# Altium schematic sheet BMC.SchDoc
size 420 x 297 mm; Scale: 1:1; DocumentType: Схема электрическая принципиальная; SheetNumber: 30; SheetTotal: 32; DocumentTypeShort: Э3; DocumentInvertoryNumber: ㅤ
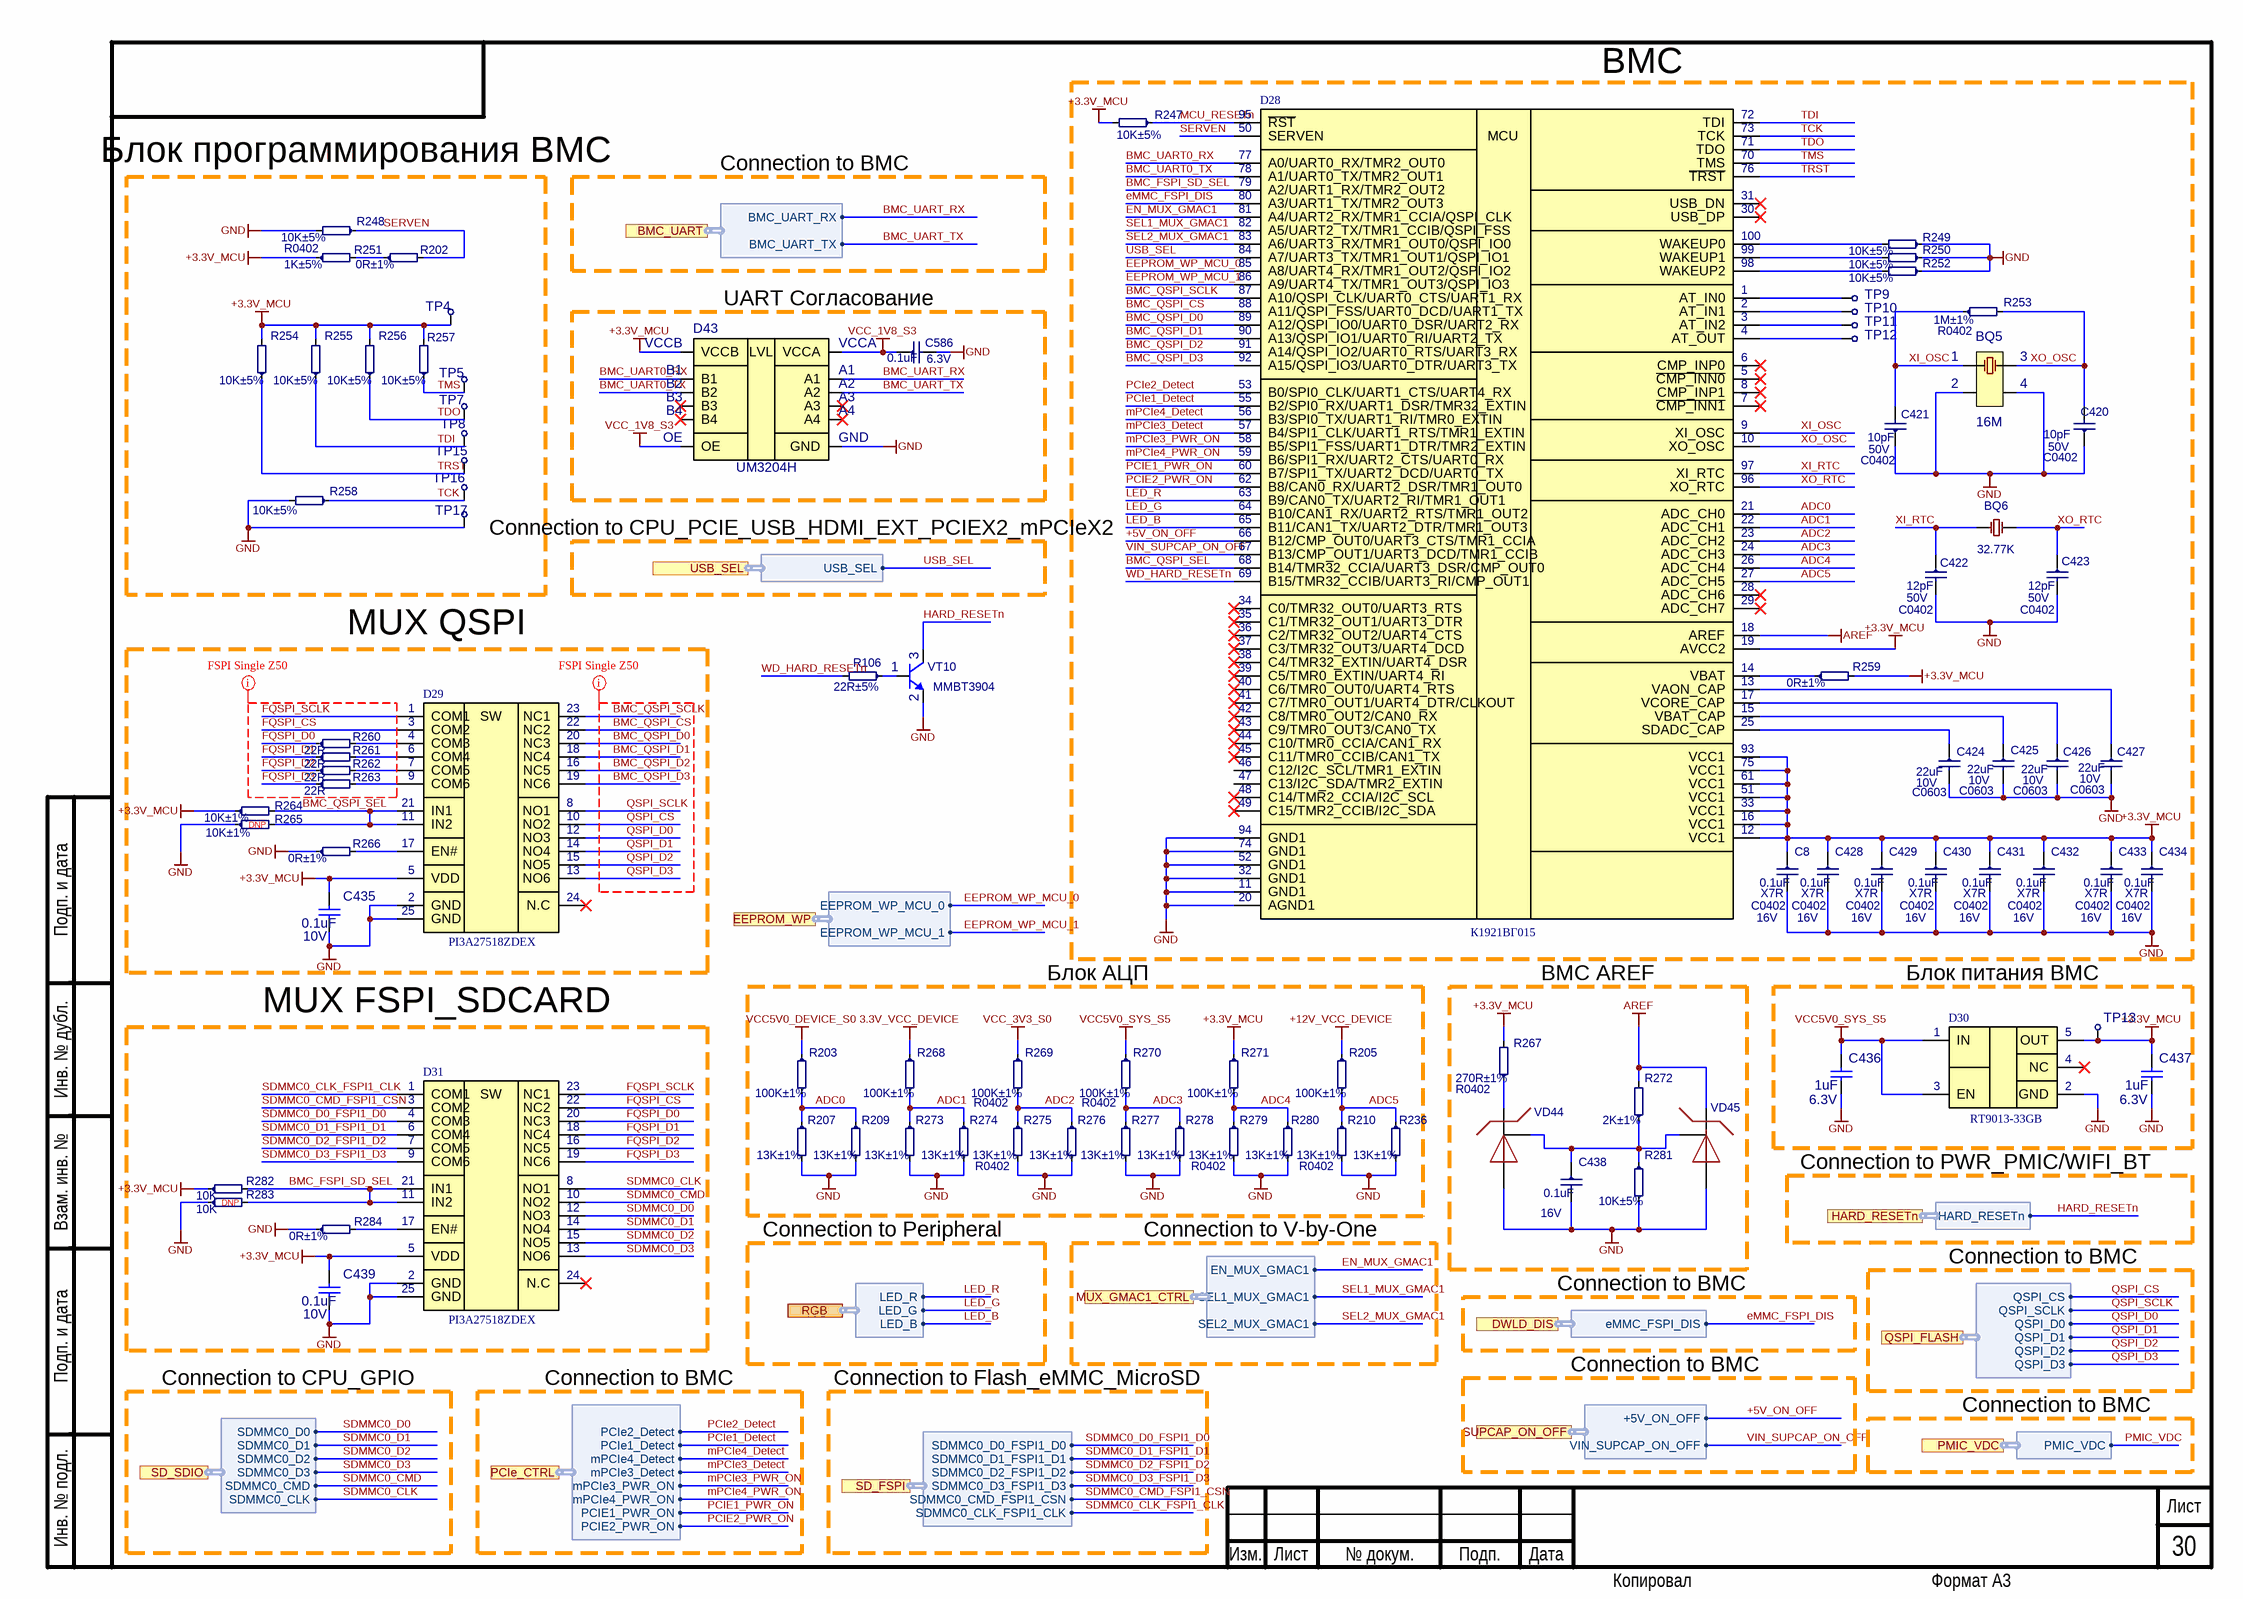
[diagram p0: BMC.SchDoc]

## Parts
BQ5  16M  [NX3225GA]
BQ6  32.77K  [FC-12M]
C8  0.1uF  Dielectric: X7R  Voltage: 16V  [C0402]
C420  10pF  Voltage: 50V  [C0402]
C421  10pF  Voltage: 50V  [C0402]
C422  12pF  Voltage: 50V  [C0402]
C423  12pF  Voltage: 50V  [C0402]
C424  22uF  Voltage: 10V  [C0603]
C425  22uF  Voltage: 10V  [C0603]
C426  22uF  Voltage: 10V  [C0603]
C427  22uF  Voltage: 10V  [C0603]
C428  0.1uF  Dielectric: X7R  Voltage: 16V  [C0402]
C429  0.1uF  Dielectric: X7R  Voltage: 16V  [C0402]
C430  0.1uF  Dielectric: X7R  Voltage: 16V  [C0402]
C431  0.1uF  Dielectric: X7R  Voltage: 16V  [C0402]
C432  0.1uF  Dielectric: X7R  Voltage: 16V  [C0402]
C433  0.1uF  Dielectric: X7R  Voltage: 16V  [C0402]
C434  0.1uF  Dielectric: X7R  Voltage: 16V  [C0402]
C435  0.1uF  Voltage: 10V  [C0402]
C436  1uF  Voltage: 6.3V  [C0402]
C437  1uF  Voltage: 6.3V  [C0402]
C438  0.1uF  Voltage: 16V  [C0402]
C439  0.1uF  Voltage: 10V  [C0402]
C586  0.1uF  Voltage: 6.3V  [C0201]
D28  К1921ВГ015  [К1921ВГ015]
D29  PI3A27518ZDEX  [PI3A27518ZDEX]
D30  RT9013-33GB  [RT9013-25GB]
D31  PI3A27518ZDEX  [PI3A27518ZDEX]
D43  UM3204H  [UM3204H]
R106  22R±5%  [R0402]
R202  0R±1%  [R0402]
R203  100K±1%  [R0402]
R205  100K±1%  [R0402]
R207  13K±1%  [R0402]
R209  13K±1%  [R0402]
R210  13K±1%  [R0402]
R236  13K±1%  [R0402]
R247  10K±5%  [R0402]
R248  10K±5%  [R0402]
R249  10K±5%  [R0402]
R250  10K±5%  [R0402]
R251  1K±5%  [R0402]
R252  10K±5%  [R0402]
R253  1M±1%  [R0402]
R254  10K±5%  [R0402]
R255  10K±5%  [R0402]
R256  10K±5%  [R0402]
R257  10K±5%  [R0402]
R258  10K±5%  [R0402]
R259  0R±1%  [R0402]
R260  22R  [R0402]
R261  22R  [R0402]
R262  22R  [R0402]
R263  22R  [R0402]
R264  10K±1%  [R0402]
R265  10K±1%  [R0402]
R266  0R±1%  [R0402]
R267  270R±1%  [R0402]
R268  100K±1%  [R0402]
R269  100K±1%  [R0402]
R270  100K±1%  [R0402]
R271  100K±1%  [R0402]
R272  2K±1%  [R0402]
R273  13K±1%  [R0402]
R274  13K±1%  [R0402]
R275  13K±1%  [R0402]
R276  13K±1%  [R0402]
R277  13K±1%  [R0402]
R278  13K±1%  [R0402]
R279  13K±1%  [R0402]
R280  13K±1%  [R0402]
R281  10K±5%  [R0402]
R282  10K  [R0402]
R283  10K  [R0402]
R284  0R±1%  [R0402]
TP4  Тестовая точка  [TEST]  (value not drawn)  (no BOM)
TP5  Тестовая точка  [TEST]  (value not drawn)  (no BOM)
TP7  Тестовая точка  [TEST]  (value not drawn)  (no BOM)
TP8  Тестовая точка  [TEST]  (value not drawn)  (no BOM)
TP9  Тестовая точка  [TEST]  (value not drawn)  (no BOM)
TP10  Тестовая точка  [TEST]  (value not drawn)  (no BOM)
TP11  Тестовая точка  [TEST]  (value not drawn)  (no BOM)
TP12  Тестовая точка  [TEST]  (value not drawn)  (no BOM)
TP13  Тестовая точка  [TEST]  (value not drawn)  (no BOM)
TP15  Тестовая точка  [TEST]  (value not drawn)  (no BOM)
TP16  Тестовая точка  [TEST]  (value not drawn)  (no BOM)
TP17  Тестовая точка  [TEST]  (value not drawn)  (no BOM)
VD44  TL431AIDBZR  [TL431AIDBZR]  (value not drawn)
VD45  TL432AIDBZR  [TL432AIDBZR]  (value not drawn)
VT10  MMBT3904  [SOT23]

## Blocks framed on the sheet
UART Согласование: C586 D43
Блок АЦП: R203 R205 R207 R209 R210 R236 R268-R271 R273-R280
BMC AREF: C438 R267 R272 R281 VD44 VD45
Блок питания BMC: C436 C437 D30 TP13

## Ports
BMC_UART (harness BMC_UART), DWLD_DIS (harness DWLD_DIS), EEPROM_WP (harness EEPROM_WP), HARD_RESETn (harness HARD_RESETn), MUX_GMAC1_CTRL (harness MUX_GMAC1_CTRL), PCIe_CTRL (harness PCIe_CTRL), PMIC_VDC (harness PMIC_VDC), QSPI_FLASH (harness QSPI_FLASH), RGB (harness RGB), SD_FSPI (harness SD_FSPI), SD_SDIO (harness SD_SDIO), SUPCAP_ON_OFF (harness SUPCAP_ON_OFF), USB_SEL (harness USB_SEL)

## Harnesses
PCIe_CTRL: PCIe2_Detect, PCIe1_Detect, mPCIe4_Detect, mPCIe3_Detect, mPCIe3_PWR_ON, mPCIe4_PWR_ON, PCIE1_PWR_ON, PCIE2_PWR_ON
SD_SDIO: SDMMC0_D0, SDMMC0_D1, SDMMC0_D2, SDMMC0_D3, SDMMC0_CMD, SDMMC0_CLK
SD_FSPI: SDMMC0_D0_FSPI1_D0, SDMMC0_D1_FSPI1_D1, SDMMC0_D2_FSPI1_D2, SDMMC0_D3_FSPI1_D3, SDMMC0_CMD_FSPI1_CSN, SDMMC0_CLK_FSPI1_CLK
QSPI_FLASH: QSPI_CS, QSPI_SCLK, QSPI_D0, QSPI_D1, QSPI_D2, QSPI_D3
SUPCAP_ON_OFF: +5V_ON_OFF, VIN_SUPCAP_ON_OFF
PMIC_VDC: PMIC_VDC
DWLD_DIS: eMMC_FSPI_DIS
RGB: LED_G, LED_R, LED_B
MUX_GMAC1_CTRL: SEL1_MUX_GMAC1, EN_MUX_GMAC1, SEL2_MUX_GMAC1
HARD_RESETn: HARD_RESETn
BMC_UART: BMC_UART_RX, BMC_UART_TX
USB_SEL: USB_SEL
EEPROM_WP: EEPROM_WP_MCU_0, EEPROM_WP_MCU_1

## Nets
3.3V_VCC_DEVICE: R268.1
+3.3V_MCU: C8.1 C428.1 C429.1 C430.1 C431.1 C432.1 C433.1 C434.1 C435.2 C437.2 C439.2 D28.12(VCC1) D28.16(VCC1) D28.19(AVCC2) D28.33(VCC1) D28.51(VCC1) D28.61(VCC1) D28.75(VCC1) D28.93(VCC1) D29.5(VDD) D30.5(OUT) D31.5(VDD) D43.VCCB R247.2 R251.1 R254.2 R255.2 R256.2 R257.2 R259.2 R264.1 R267.2 R271.1 R282.1 TP4.1 TP13.1
+12V_VCC_DEVICE: R205.1
AREF: D28.18(AREF) R272.2 VD45.2(K)
GND: BQ5.2 BQ5.4 C8.2 C420.1 C421.1 C422.2 C423.2 C424.2 C425.2 C426.2 C427.2 C428.2 C429.2 C430.2 C431.2 C432.2 C433.2 C434.2 C435.1 C436.1 C437.1 C438.2 C439.1 C586.2 D28.11(GND1) D28.20(AGND1) D28.32(GND1) D28.52(GND1) D28.74(GND1) D28.94(GND1) D29.2(GND) D29.25(GND) D30.2(GND) D31.2(GND) D31.25(GND) D43.GND R207.2 R209.2 R210.2 R236.2 R248.2 R249.1 R250.1 R252.1 R258.2 R265.1 R266.1 R273.2 R274.2 R275.2 R276.2 R277.2 R278.2 R279.2 R280.2 R281.2 R283.1 R284.1 TP17.1 VD44.3(A) VD45.3(A) VT10.2(E)
VCC5V0_DEVICE_S0: R203.1
VCC5V0_SYS_S5: C436.2 D30.1(IN) D30.3(EN) R270.1
VCC_1V8_S3: C586.1 D43.OE D43.VCCA
VCC_3V3_S0: R269.1
+5V_ON_OFF: D28.66(B12/CMP_OUT0/UART3_CTS/TMR1_CCIA) ; port SUPCAP_ON_OFF.+5V_ON_OFF
ADC0: D28.21(ADC_CH0) R203.2 R207.1 R209.1
ADC1: D28.22(ADC_CH1) R268.2 R273.1 R274.1
ADC2: D28.23(ADC_CH2) R269.2 R275.1 R276.1
ADC3: D28.24(ADC_CH3) R270.2 R277.1 R278.1
ADC4: D28.26(ADC_CH4) R271.2 R279.1 R280.1
ADC5: D28.27(ADC_CH5) R205.2 R210.1 R236.1
BMC_FSPI_SD_SEL: D28.79(A2/UART1_RX/TMR2_OUT2) D31.11(IN2) D31.21(IN1) R282.2 R283.2
BMC_QSPI_CS: D28.88(A11/QSPI_FSS/UART0_DCD/UART1_TX) D29.22(NC2)
BMC_QSPI_D0: D28.89(A12/QSPI_IO0/UART0_DSR/UART2_RX) D29.20(NC3)
BMC_QSPI_D1: D28.90(A13/QSPI_IO1/UART0_RI/UART2_TX) D29.18(NC4)
BMC_QSPI_D2: D28.91(A14/QSPI_IO2/UART0_RTS/UART3_RX) D29.16(NC5)
BMC_QSPI_D3: D28.92(A15/QSPI_IO3/UART0_DTR/UART3_TX) D29.19(NC6)
BMC_QSPI_SCLK: D28.87(A10/QSPI_CLK/UART0_CTS/UART1_RX) D29.23(NC1)
BMC_QSPI_SEL: D28.68(B14/TMR32_CCIA/UART3_DSR/CMP_OUT0) D29.11(IN2) D29.21(IN1) R264.2 R265.2
BMC_UART0_RX: D28.77(A0/UART0_RX/TMR2_OUT0) D43.B1
BMC_UART0_TX: D28.78(A1/UART0_TX/TMR2_OUT1) D43.B2
BMC_UART_RX: D43.A1 ; port BMC_UART.BMC_UART_RX
BMC_UART_TX: D43.A2 ; port BMC_UART.BMC_UART_TX
EEPROM_WP_MCU_0: D28.85(A8/UART4_RX/TMR1_OUT2/QSPI_IO2) ; port EEPROM_WP.EEPROM_WP_MCU_0
EEPROM_WP_MCU_1: D28.86(A9/UART4_TX/TMR1_OUT3/QSPI_IO3) ; port EEPROM_WP.EEPROM_WP_MCU_1
eMMC_FSPI_DIS: D28.80(A3/UART1_TX/TMR2_OUT3) ; port DWLD_DIS.eMMC_FSPI_DIS
EN_MUX_GMAC1: D28.81(A4/UART2_RX/TMR1_CCIA/QSPI_CLK) ; port MUX_GMAC1_CTRL.EN_MUX_GMAC1
FQSPI_CS: D29.3(COM2) D31.22(NC2)
FQSPI_D0: D31.20(NC3) R260.1
FQSPI_D1: D31.18(NC4) R261.1
FQSPI_D2: D31.16(NC5) R262.1
FQSPI_D3: D31.19(NC6) R263.1
FQSPI_SCLK: D29.1(COM1) D31.23(NC1)
HARD_RESETn: VT10.3(C) ; port HARD_RESETn.HARD_RESETn
LED_B: D28.65(B11/CAN1_TX/UART2_DTR/TMR1_OUT3) ; port RGB.LED_B
LED_G: D28.64(B10/CAN1_RX/UART2_RTS/TMR1_OUT2) ; port RGB.LED_G
LED_R: D28.63(B9/CAN0_TX/UART2_RI/TMR1_OUT1) ; port RGB.LED_R
MCU_RESETn: D28.95(~{RST}) R247.1
mPCIe3_Detect: D28.57(B4/SPI1_CLK/UART1_RTS/TMR1_EXTIN) ; port PCIe_CTRL.mPCIe3_Detect
mPCIe3_PWR_ON: D28.58(B5/SPI1_FSS/UART1_DTR/TMR2_EXTIN) ; port PCIe_CTRL.mPCIe3_PWR_ON
mPCIe4_Detect: D28.56(B3/SPI0_TX/UART1_RI/TMR0_EXTIN) ; port PCIe_CTRL.mPCIe4_Detect
mPCIe4_PWR_ON: D28.59(B6/SPI1_RX/UART2_CTS/UART0_RX) ; port PCIe_CTRL.mPCIe4_PWR_ON
PCIe1_Detect: D28.55(B2/SPI0_RX/UART1_DSR/TMR32_EXTIN) ; port PCIe_CTRL.PCIe1_Detect
PCIE1_PWR_ON: D28.60(B7/SPI1_TX/UART2_DCD/UART0_TX) ; port PCIe_CTRL.PCIE1_PWR_ON
PCIe2_Detect: D28.53(B0/SPI0_CLK/UART1_CTS/UART4_RX) ; port PCIe_CTRL.PCIe2_Detect
PCIE2_PWR_ON: D28.62(B8/CAN0_RX/UART2_DSR/TMR1_OUT0) ; port PCIe_CTRL.PCIE2_PWR_ON
PMIC_VDC: port PMIC_VDC.PMIC_VDC
QSPI_CS: D29.10(NO2) ; port QSPI_FLASH.QSPI_CS
QSPI_D0: D29.12(NO3) ; port QSPI_FLASH.QSPI_D0
QSPI_D1: D29.14(NO4) ; port QSPI_FLASH.QSPI_D1
QSPI_D2: D29.15(NO5) ; port QSPI_FLASH.QSPI_D2
QSPI_D3: D29.13(NO6) ; port QSPI_FLASH.QSPI_D3
QSPI_SCLK: D29.8(NO1) ; port QSPI_FLASH.QSPI_SCLK
SDMMC0_CLK: D31.8(NO1) ; port SD_SDIO.SDMMC0_CLK
SDMMC0_CLK_FSPI1_CLK: D31.1(COM1) ; port SD_FSPI.SDMMC0_CLK_FSPI1_CLK
SDMMC0_CMD: D31.10(NO2) ; port SD_SDIO.SDMMC0_CMD
SDMMC0_CMD_FSPI1_CSN: D31.3(COM2) ; port SD_FSPI.SDMMC0_CMD_FSPI1_CSN
SDMMC0_D0: D31.12(NO3) ; port SD_SDIO.SDMMC0_D0
SDMMC0_D0_FSPI1_D0: D31.4(COM3) ; port SD_FSPI.SDMMC0_D0_FSPI1_D0
SDMMC0_D1: D31.14(NO4) ; port SD_SDIO.SDMMC0_D1
SDMMC0_D1_FSPI1_D1: D31.6(COM4) ; port SD_FSPI.SDMMC0_D1_FSPI1_D1
SDMMC0_D2: D31.15(NO5) ; port SD_SDIO.SDMMC0_D2
SDMMC0_D2_FSPI1_D2: D31.7(COM5) ; port SD_FSPI.SDMMC0_D2_FSPI1_D2
SDMMC0_D3: D31.13(NO6) ; port SD_SDIO.SDMMC0_D3
SDMMC0_D3_FSPI1_D3: D31.9(COM6) ; port SD_FSPI.SDMMC0_D3_FSPI1_D3
SEL1_MUX_GMAC1: D28.82(A5/UART2_TX/TMR1_CCIB/QSPI_FSS) ; port MUX_GMAC1_CTRL.SEL1_MUX_GMAC1
SEL2_MUX_GMAC1: D28.83(A6/UART3_RX/TMR1_OUT0/QSPI_IO0) ; port MUX_GMAC1_CTRL.SEL2_MUX_GMAC1
SERVEN: D28.50(SERVEN) R202.2 R248.1
TCK: D28.73(TCK) R258.1 TP16.1
TDI: D28.72(TDI) R255.1 TP8.1
TDO: D28.71(TDO) R256.1 TP7.1
TMS: D28.70(TMS) R257.1 TP5.1
TRST: D28.76(~{TRST}) R254.1 TP15.1
USB_SEL: D28.84(A7/UART3_TX/TMR1_OUT1/QSPI_IO1) ; port USB_SEL.USB_SEL
VIN_SUPCAP_ON_OFF: D28.67(B13/CMP_OUT1/UART3_DCD/TMR1_CCIB) ; port SUPCAP_ON_OFF.VIN_SUPCAP_ON_OFF
WD_HARD_RESETn: D28.69(B15/TMR32_CCIB/UART3_RI/CMP_OUT1) R106.2
XI_OSC: BQ5.1 C421.2 D28.9(XI_OSC) R253.1
XI_RTC: BQ6.1(inp) C422.1 D28.97(XI_RTC)
XO_OSC: BQ5.3 C420.2 D28.10(XO_OSC) R253.2
XO_RTC: BQ6.2(out) C423.1 D28.96(XO_RTC)
NetC424_1: C424.1 D28.25(SDADC_CAP)
NetC425_1: C425.1 D28.15(VBAT_CAP)
NetC426_1: C426.1 D28.17(VCORE_CAP)
NetC427_1: C427.1 D28.13(VAON_CAP)
NetC438_1: C438.1 R272.1 R281.1 VD44.2(REF) VD45.1(REF)
NetD28_1: D28.1(AT_IN0) TP9.1
NetD28_2: D28.2(AT_IN1) TP10.1
NetD28_3: D28.3(AT_IN2) TP11.1
NetD28_4: D28.4(AT_OUT) TP12.1
NetD28_14: D28.14(VBAT) R259.1
NetD28_98: D28.98(WAKEUP2) R252.2
NetD28_99: D28.99(WAKEUP1) R250.2
NetD28_100: D28.100(WAKEUP0) R249.2
NetD29_4: D29.4(COM3) R260.2
NetD29_6: D29.6(COM4) R261.2
NetD29_7: D29.7(COM5) R262.2
NetD29_9: D29.9(COM6) R263.2
NetD29_17: D29.17(EN#) R266.2
NetD31_17: D31.17(EN#) R284.2
NetR106_1: R106.1 VT10.1(B)
NetR202_1: R202.1 R251.2
NetR267_1: R267.1 VD44.1(K)

Not connected (* = marked no-connect by the designer): D28 5(~{CMP_INN0})* 6(CMP_INP0)* 7(~{CMP_INN1})* 8(CMP_INP1)* 28(ADC_CH6)* 29(ADC_CH7)* 30(USB_DP)* 31(USB_DN)* 34(C0/TMR32_OUT0/UART3_RTS)* 35(C1/TMR32_OUT1/UART3_DTR)* 36(C2/TMR32_OUT2/UART4_CTS)* 37(C3/TMR32_OUT3/UART4_DCD)* 38(C4/TMR32_EXTIN/UART4_DSR)* 39(C5/TMR0_EXTIN/UART4_RI)* 40(C6/TMR0_OUT0/UART4_RTS)* 41(C7/TMR0_OUT1/UART4_DTR/CLKOUT)* 42(C8/TMR0_OUT2/CAN0_RX)* 43(C9/TMR0_OUT3/CAN0_TX)* 44(C10/TMR0_CCIA/CAN1_RX)* 45(C11/TMR0_CCIB/CAN1_TX)* 46(C12/I2C_SCL/TMR1_EXTIN) 47(C13/I2C_SDA/TMR2_EXTIN) 48(C14/TMR2_CCIA/I2C_SCL)* 49(C15/TMR2_CCIB/I2C_SDA)*; D29 24(N.C)*; D30 4(NC)*; D31 24(N.C)*; D43 A3* A4* B3* B4*

## Layout directives
net class FSPI: BMC_QSPI_CS, BMC_QSPI_D0, BMC_QSPI_D1, BMC_QSPI_D2, BMC_QSPI_D3, BMC_QSPI_SCLK, FQSPI_CS, FQSPI_D0, FQSPI_D1, FQSPI_D2, FQSPI_D3, FQSPI_SCLK, QSPI_CS, QSPI_D0, QSPI_D1, QSPI_D2, QSPI_D3, QSPI_SCLK

## Notes on the sheet
- (near D28) BMC
- Блок программирования BMC
- Connection to BMC
- Connection to CPU_PCIE_USB_HDMI_EXT_PCIEX2_mPCIeX2
- MUX QSPI
- (near R265) DNP
- MUX FSPI_SDCARD
- (near R283) DNP
- Connection to PWR_PMIC/WIFI_BT
- Connection to Peripheral
- Connection to V-by-One
- Connection to CPU_GPIO
- Connection to Flash_eMMC_MicroSD
- Подп. и дата
- Инв. № дубл.
- Взам. инв. №
- Инв. № подл.
- Изм.
- Лист
- № докум.
- Подп.
- Дата
- Копировал
- Формат А3
- (in symbol PI3A27518ZDEX) SW
- (in symbol UM3204H) LVL
- (in symbol К1921ВГ015) MCU

## Library data of the parts
BQ5 = X322516MLB4SI: 16MHz 3225 quartz; Manufacturer: YXC; Place: *); Tolerance: 30ppm; Check: False; Part Number: X322516MLB4SI; Value: 16M; Temperature: -40°C~85°C; NameFromManufacturer: X322516MLB4SI; ComponentLink1Description: DATASHEET; ComponentLink1URL: https://www.electronshik.ru/item/YXC/X322516MLB4SI; Datasheet: Darasheets/quartz/YSX321SL.pdf#http://Darasheets/quartz/YSX321SL.pdf#; Last changed: 18.05.2023
BQ6 = NX2012SA-32.768K-STD-MUB-1: CRYSTAL 32.768KHZ 12.5PF SMD; Manufacturer: NDK; Place: *); Check: False; Part Number: NX2012SA-32.768K-STD-MUB-1; Value: 32.77K; Temperature: -40°C~85°C; NameFromManufacturer: NX2012SA-32.768K-STD-MUB-1; ComponentLink1Description: DATASHEET; ComponentLink1URL: https://ru.mouser.com/ProductDetail/NDK/NX2012SA-32768K-STD-MUB-1?qs=55YtniHzbhA%252B6%2Fl1MwFZaQ%3D%3D; Datasheet: Datasheets/quartz/c_NX2012SA_e.pdf; Last changed: 27.10.2022
C8 C428-C434 C438 = 0402-X7R-16V-0.1uF±10%: Ceramic Capacitor 0402 100nF ±5% 16V X7R; Manufacturer: Yageo; NameFromManufacturer: CC0402JRX7R7BB104; Place: *); Tolerance: 10%; Check: False; Case: C0402; Part Number: 0402-X7R-16V-0.1uF±10%; Value: 0.1uF; Temperature: -55°C~125°C; ComponentLink2Description: Link to datasheet; ComponentLink1Description: DATASHEET; ComponentLink2URL: https://www.yageo.com/upload/media/product/productsearch/datasheet/mlcc/UPY-GPHC_X7R_6.3V-to-50V_18.pdf; ComponentLink1URL: Datasheets/capacitors/UPY-GPHC_X7R_6.3V-to-50V_18.pdf; Last changed: 10/27/2022
  C438: Dielectric: X7R
C420 C421 = 0402-NP0-50V-10pF±5%: Manufacturer: Yageo; NameFromManufacturer: CC0402JRNPO9BN100; Dielectric: NP0; Place: *); Tolerance: 5%; Check: False; Case: C0402; Part Number: 0402-NP0-50V-10pF±5%; Value: 10pF; Temperature: -55°C~125°C; ComponentLink2Description: Link to datasheet; ComponentLink1Description: DATASHEET; ComponentLink2URL: https://www.terraelectronica.ru/pdf/show?pdf_file=%252Fds%252Fpdf%252FN%252Fnpo.pdf; ComponentLink1URL: Datasheets/capacitors/DOC012565825.pdf; Last changed: 27.10.2022
C422 C423 = 0402-NP0-50V-12pF±5%: Manufacturer: Murata Electronics; NameFromManufacturer: GRM1555C1H120JA01D; Dielectric: NP0; Place: *); Tolerance: 5%; Check: False; Case: C0402; Part Number: 0402-NP0-50V-12pF±5%; Value: 12pF; Temperature: -55°C~125°C; ComponentLink2Description: Link to datasheet; ComponentLink1Description: DATASHEET; ComponentLink2URL: https://www.terraelectronica.ru/pdf/show?pdf_file=http%253A%252F%252Fwww.farnell.com%252Fdatasheets%252F2048662.pdf; ComponentLink1URL: Datasheets/capacitors/GRM1555C1H120JA01-01A.pdf; Last changed: 27.10.2022
C424-C427 = 0603-X5R-10V-22uF±20%: *; Manufacturer: Samsung Electro-Mechanics; NameFromManufacturer: CL10A226MQ8NRNE; Dielectric: X5R; Place: *); Tolerance: 20%; Check: False; Case: C0603; Part Number: 0603-X5R-10V-22uF±20%; Value: 22uF; Temperature: -55°C~85°C; ComponentLink2Description: Link to datasheet; ComponentLink1Description: DATASHEET; ComponentLink2URL: https://www.lcsc.com/product-detail/Multilayer-Ceramic-Capacitors-MLCC-SMD-SMT_Samsung-Electro-Mechanics-CL10A226MQ8NRNE_C159801.html; ComponentLink1URL: Datasheets/capacitors/1810261912_Samsung-Electro-Mechanics-CL10A226MQ8NRNE_C159801.pdf#Datasheets/capacitors/1810261912_Samsung-Electro-Mechanics-CL10A226MQ8NRNE_C159801.pdf#; Last changed: 05.12.2022
C435 C439 = 0402-X7R-16V-0.1uF±10%: Part Number: 0402-X5R-10V-0.1uF±10%; Manufacturer: Yageo; NameFromManufacturer: CC0402KRX5R6BB104; Place: S; Tolerance: 10%; Check: False; Value: 0.1uF; Temperature: -55°C~125°C; ComponentLink2Description: Link to datasheet; ComponentLink1Description: DATASHEET; Last changed: 27.10.2022
C436 C437 = 0402-X7R-6.3V-1uF±10%: Manufacturer: Yageo; NameFromManufacturer: CC0402KRX7R5BB105; Place: S; Tolerance: 10%; Check: False; Part Number: 0402-X7R-6.3V-1uF±10%; Value: 1uF; Temperature: -55°C~125°C; ComponentLink2Description: Link to datasheet; ComponentLink1Description: DATASHEET; ComponentLink2URL: https://www.terraelectronica.ru/product/1352679; ComponentLink1URL: Datasheets/capacitors/UPY-GPHC_X7R_6.3V-to-50V_20.pdf; Last changed: 27.10.2022
C586 = 0201-X5R-6.3V-0.1uF±10%: Manufacturer: Yageo; NameFromManufacturer: CC0201KRX5R5BB104; Dielectric: X5R; Place: *); Tolerance: 10%; Check: False; Case: C0201; Part Number: 0201-X5R-6.3V-0.1uF±10%; Value: 0.1uF; Temperature: -55°C~85°C; ComponentLink2Description: Link to datasheet; ComponentLink1Description: DATASHEET; ComponentLink2URL: https://www.terraelectronica.ru/product/1020032; ComponentLink1URL: Datasheets/capacitors/UPY-GPHC_X5R_4V-to-50V_27.pdf; Last changed: 27.10.2022
D28 = К1921ВГ015: 32-разрядный ультранизкопотребляющий микроконтроллер RISС-V в пластиковом корпусе.; Manufacturer: НИИЭТ; Check: False; Part Number: К1921ВГ015; Value: К1921ВГ015; NameFromManufacturer: К1921ВГ015
D29 D31 = PI3A27518ZDEX: 1.8/3.3V High-Bandwidth 6-channel, 2:1 Mux/DeMux; Manufacturer: Diodes Incorporated; Check: False; Part Number: PI3A27518ZDEX; NameFromManufacturer: PI3A27518ZDEX; Value: PI3A27518ZDEX
D30 = RT9013-25GB: Linear Voltage Regulators   500mA 50dB@(10kHz) Fixed 3.3V; Manufacturer: Richtek; Check: False; Part Number: RT9013-33GB; NameFromManufacturer: RT9013-33GB; Value: RT9013-33GB
D43 = UM3204H: CSP-12(1.4x1.9) Translators, Level Shifters ROHS; Manufacturer: Union; Check: False; Part Number: UM3204H; Value: UM3204H; NameFromManufacturer: UM3204H
R106 = 0402-0.0625W-22R-100ppm±5%: NameFromManufacturer: RC0402JR-0722RL; Manufacturer: Yageo; Place: *); Value: 22R; Tolerance: 5%; Check: False; Case: R0402; Part Number: 0402-0.0625W-22R-100ppm±5%; Temperature: -55°C~155°C; ComponentLink1Description: DATASHEET; ComponentLink1URL: https://www.terraelectronica.ru/pdf/show?pdf_file=%252Fds%252Fpdf%252FR%252FRC0402.pdf; Datasheet: Datasheets/resistors/PYu-RC_Group_51_RoHS_L_12.pdf; Last changed: 27.10.2022
R202 R259 R266 R284 = 0402-0.0625W-0R-100ppm±1%: Chip Resistor 0402 0Ω ±1% 50V ±100ppm/℃ Thick Film; NameFromManufacturer: RC0402FR-070RL; Manufacturer: Yageo; Place: *); Value: 0R; Check: False; Case: R0402; Part Number: 0402-0.0625W-0R-100ppm±1%; Tolerance: 1%; Temperature: -55°C~155°C; ComponentLink1Description: DATASHEET; ComponentLink1URL: https://www.chipdip.ru/product0/8000617426?ysclid=l7og5x0plo427794326; Datasheet: Datasheets/resistors/DOC012445956.pdf; Last changed: 27.10.2022
R203 R205 R268-R271 = 0402-0.0625W-100K-100ppm±1%: Chip Resistor 0402 100kΩ ±1% 50V ±100ppm/℃ Thick Film; NameFromManufacturer: RC0402FR-07100KL; Manufacturer: Yageo; Place: *); Value: 100K; Check: False; Case: R0402; Part Number: 0402-0.0625W-100K-100ppm±1%; Tolerance: 1%; Temperature: -55°C~155°C; ComponentLink1Description: DATASHEET; ComponentLink1URL: https://www.yageo.com/upload/media/product/productsearch/datasheet/rchip/PYu-RC_Group_51_RoHS_L_11.pdf; Datasheet: Datasheets/resistors/PYu-RC_Group_51_RoHS_L_11.pdf; Last changed: 27.10.2022
R207 R209 R210 R236 R273-R280 = 0402-0.0625W-13K-100ppm±1%: NameFromManufacturer: RC0402FR-0713KL; Manufacturer: Yageo; Place: *); Value: 13K; Tolerance: 1%; Check: False; Case: R0402; Part Number: 0402-0.0625W-13K-100ppm±1%; Temperature: -55°C~155°C; ComponentLink1Description: DATASHEET; ComponentLink1URL: https://www.electronshik.ru/item/YAG/RC0402FR-0713KL; Datasheet: Datasheets/resistors/PYu-RC_Group_51_RoHS_L_12.pdf; Last changed: 27.10.2022
R247-R250 R252 R254-R258 R281 = 0402-0.0625W-10K-100ppm±5%: NameFromManufacturer: RC0402JR-0710KL; Manufacturer: Yageo; Place: *); Value: 10K; Tolerance: 5%; Check: False; Case: R0402; Part Number: 0402-0.0625W-10K-100ppm±5%; Temperature: -55°C~155°C; ComponentLink1Description: DATASHEET; ComponentLink1URL: https://ru.mouser.com/ProductDetail/YAGEO/RC0402JR-0710KL?qs=%2Fha2pyFadugNN0LzwXn2qF8HRAp201xOpXu%252BapQnyvRGE%2F%252Bpr1TWjQ%3D%3D; Datasheet: Datasheets/resistors/PYu-RC_Group_51_RoHS_L_11.pdf; Last changed: 27.10.2022
R251 = 0402-0.0625W-1K-100ppm±5%: NameFromManufacturer: RC0402JR-071KL; Manufacturer: Yageo; Place: *); Value: 1K; Tolerance: 5%; Check: False; Case: R0402; Part Number: 0402-0.0625W-1K-100ppm±5%; Temperature: -55°C~155°C; ComponentLink1Description: DATASHEET; ComponentLink1URL: https://ru.mouser.com/ProductDetail/YAGEO/RC0402JR-071KL?qs=%2Fha2pyFadugNN0LzwXn2qBG%2Fxv0pCy6gh7Z%252B1hZJT2CnjLeHVORGDQ%3D%3D; Datasheet: Datasheets/resistors/PYu-RC_Group_51_RoHS_L_11.pdf; Last changed: 27.10.2022
R253 = 0402-0.0625W-1M-100ppm±1%: Chip Resistor 0402 1MΩ ±1% 50V ±100ppm/℃ Thick Film; NameFromManufacturer: RC0402FR-071ML; Manufacturer: Yageo; Place: *); Value: 1M; Check: False; Case: R0402; Part Number: 0402-0.0625W-1M-100ppm±1%; Tolerance: 1%; Temperature: -55°C~155°C; ComponentLink1Description: DATASHEET; ComponentLink1URL: https://www.yageo.com/upload/media/product/productsearch/datasheet/rchip/PYu-RC_Group_51_RoHS_L_11.pdf; Datasheet: Datasheets/resistors/PYu-RC_Group_51_RoHS_L_11.pdf; Last changed: 27.10.2022
R260-R263 = 0402-0.0625W-22R-100ppm±1%: Chip Resistor 0402 22Ω ±1% 50V ±100ppm/℃ Thick Film; NameFromManufacturer: RC0402FR-0722RL; Manufacturer: Yageo; Place: *); Check: False; Case: R0402; Part Number: 0402-0.0625W-22R-100ppm±1%; Value: 22R; Tolerance: 1%; Temperature: -55°C~155°C; ComponentLink1Description: DATASHEET; ComponentLink1URL: https://www.yageo.com/upload/media/product/productsearch/datasheet/rchip/PYu-RC_Group_51_RoHS_L_11.pdf; Datasheet: Datasheets/resistors/PYu-RC_Group_51_RoHS_L_11.pdf; Last changed: 27.10.2022
R264 R265 = 0402-0.0625W-10K-100ppm±1%: Chip Resistor 0402 10kΩ ±1% 50V ±100ppm/℃ Thick Film; NameFromManufacturer: RC0402FR-0710KL; Manufacturer: Yageo; Place: *); Value: 10K; Check: False; Case: R0402; Part Number: 0402-0.0625W-10K-100ppm±1%; Tolerance: 1%; Temperature: -55°C~155°C; ComponentLink1Description: DATASHEET; ComponentLink1URL: https://ru.mouser.com/ProductDetail/YAGEO/RC0402FR-0710KL?qs=%2Fha2pyFaduhjtLcYvKXQ8IogF7YwN7YtH%252BOO8ZtEEMnoa4yoWYcwpw%3D%3D; Datasheet: Datasheets/resistors/PYu-RC_Group_51_RoHS_L_11.pdf; Last changed: 27.10.2022
R267 = 0402-0.0625W-1K-100ppm±5%: Part Number: 0402-0.0625W-270R-100ppm±1%; NameFromManufacturer: 0402WGF2700TCE; Manufacturer: UNI-ROYAL; Place: *); Value: 270R; Tolerance: 1%; Check: False; Case: R0402; Temperature: -55°C~155°C; ComponentLink1Description: DATASHEET; ComponentLink1URL: https://ru.mouser.com/ProductDetail/YAGEO/RC0402JR-071KL?qs=%2Fha2pyFadugNN0LzwXn2qBG%2Fxv0pCy6gh7Z%252B1hZJT2CnjLeHVORGDQ%3D%3D; Datasheet: Datasheets/resistors/PYu-RC_Group_51_RoHS_L_11.pdf; Last changed: 27.10.2022
R272 = 0402-0.0625W-2K-100ppm±1%: NameFromManufacturer: RC0402FR-072KL; Manufacturer: Yageo; Place: *); Value: 2K; Tolerance: 1%; Check: False; Case: R0402; Part Number: 0402-0.0625W-2K-100ppm±1%; Temperature: -55°C~155°C; ComponentLink1Description: DATASHEET; ComponentLink1URL: https://ru.mouser.com/ProductDetail/YAGEO/RC0402FR-072KL?qs=%2Fha2pyFaduhjtLcYvKXQ8CqCkWjwqUqgtfrQweQcV7%252BeDonvCaUsqQ%3D%3D; Datasheet: Datasheets/resistors/PYu-RC_Group_51_RoHS_L_11.pdf; Last changed: 27.10.2022
R282 R283 = 0402-0.0625W-10K-100ppm±1%: Chip Resistor 0402 10kΩ ±1% 50V ±100ppm/℃ Thick Film; NameFromManufacturer: RC0402FR-0710KL; Manufacturer: Yageo; Place: *); Check: False; Case: R0402; Part Number: 0402-0.0625W-10K-100ppm±1%; Value: 10K; Tolerance: 1%; Temperature: -55°C~155°C; ComponentLink1Description: DATASHEET; ComponentLink1URL: https://ru.mouser.com/ProductDetail/YAGEO/RC0402FR-0710KL?qs=%2Fha2pyFaduhjtLcYvKXQ8IogF7YwN7YtH%252BOO8ZtEEMnoa4yoWYcwpw%3D%3D; Datasheet: Datasheets/resistors/PYu-RC_Group_51_RoHS_L_11.pdf; Last changed: 27.10.2022
TP4 TP5 TP7-TP12 TP15-TP17 = Тестовая точка: *; Place: *); Check: False; Part Number: Тестовая точка; Value: Тестовая точка; ComponentLink1Description: DATASHEET; Manufacturer: *
TP13 = Тестовая точка: *; Check: False; Part Number: Тестовая точка; Value: Тестовая точка; ComponentLink1Description: DATASHEET; Manufacturer: *
VD44 = TL431AIDBZR: Manufacturer: TI; Мин выходное напряжение: 2.495 В; Макс выходное напряжение: 36 В; Выходной ток: 100 мА; Производитель: Texas Instruments; Корпус: SOT-23-3; Способ монтажа: поверхностный; Check: False; Part Number: TL431AIDBZR; Мин входное напряжение: -; Макс входное напряжение: -; URLs: https://www.chipdip.ru/product/tl431aidbzr; Value: TL431AIDBZR; NameFromManufacturer: TL431AIDBZR
VD45 = TL432AIDBZR: Manufacturer: TI; Мин выходное напряжение: 2.495 В; Макс выходное напряжение: 36 В; Выходной ток: 100 мА; Производитель: Texas Instruments; Корпус: SOT-23-3; Способ монтажа: поверхностный; Check: False; Part Number: TL432AIDBZR; Мин входное напряжение: -; Макс входное напряжение: -; URLs: https://www.chipdip.ru/product/tl431aidbzr; Value: TL432AIDBZR; NameFromManufacturer: TL432AIDBZR
VT10 = MMBT3904: NPN transistor; Manufacturer: Diotec Semiconductor; Place: S; Voltage: 40V; Check: False; Part Number: MMBT3904; Value: MMBT3904; Temperature: -55°C~150°C; ComponentLink1Description: DATASHEET; NameFromManufacturer: MMBT3904; ComponentLink1URL: https://www.terraelectronica.ru/product/607582; Datasheet: #https://diotec.com/request/datasheet/mmbt3904.pdf#; Last changeв: 01.09.2022